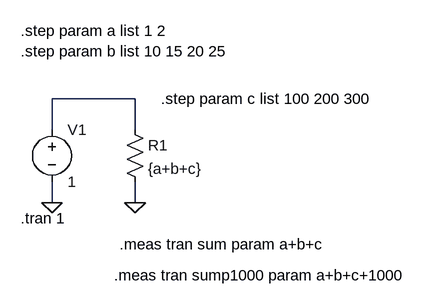
[diagram p0: schematic PCF_test1.asc]
PCF_test1.asc, the LTspice schematic file:
Version 4
SHEET 1 880 680
WIRE 208 96 80 96
WIRE 80 144 80 96
WIRE 208 144 208 96
WIRE 80 256 80 224
WIRE 208 256 208 224
FLAG 80 256 0
FLAG 208 256 0
SYMBOL voltage 80 128 R0
SYMATTR InstName V1
SYMATTR Value 1
SYMBOL res 192 128 R0
SYMATTR InstName R1
SYMATTR Value {a+b+c}
TEXT 32 -8 Left 2 !.step param a list 1 2\n.step param b list 10 15 20 25
TEXT 32 280 Left 2 !.tran 1
TEXT 248 96 Left 2 !.step param c list 100 200 300
TEXT 184 320 Left 2 !.meas tran sum param a+b+c
TEXT 176 368 Left 2 !.meas tran sump1000 param a+b+c+1000

The netlist it stands for:
* PCF_test1.asc
V1 N001 0 1
R1 N001 0 {a+b+c}
.step param a list 1 2
.step param b list 10 15 20 25
.tran 1
.step param c list 100 200 300
.meas tran sum param a+b+c
.meas tran sump1000 param a+b+c+1000
.backanno
.end